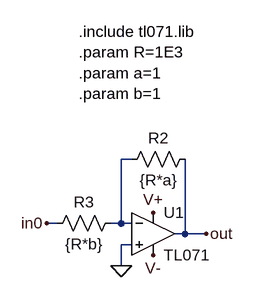
[diagram p0: schematic inverter.asc]
inverter.asc, the LTspice schematic file:
Version 4
SHEET 1 880 680
WIRE -208 -160 -224 -160
WIRE -320 -64 -336 -64
WIRE -224 -64 -224 -160
WIRE -224 -64 -240 -64
WIRE -208 -64 -224 -64
WIRE -128 -48 -128 -160
WIRE -128 -48 -144 -48
WIRE -96 -48 -128 -48
WIRE -208 -32 -224 -32
WIRE -224 0 -224 -32
FLAG -336 -64 in0
FLAG -96 -48 out
FLAG -224 0 0
FLAG -176 -80 V+
FLAG -176 -16 V-
SYMBOL res -112 -176 R90
WINDOW 0 0 56 VBottom 2
WINDOW 3 32 56 VTop 2
SYMATTR InstName R2
SYMATTR Value {R*a}
SYMBOL res -224 -80 R90
WINDOW 0 0 56 VBottom 2
WINDOW 3 32 56 VTop 2
SYMATTR InstName R3
SYMATTR Value {R*b}
SYMBOL opamp2 -176 -112 R0
SYMATTR InstName U1
SYMATTR Value TL071
TEXT -288 -352 Left 2 !.include tl071.lib\n.param R=1E3\n.param a=1\n.param b=1

The netlist it stands for:
* inverter.asc
R2 out N001 {R*a}
R3 N001 in0 {R*b}
XU1 0 N001 V+ V- out TL071  ; pins In+ In- V+ V- OUT
.include tl071.lib
.param R=1E3
.param a=1
.param b=1
.backanno
.end